# EAGLE schematic 16 ch sample-and-hold card (EAGLE 7.2.0)
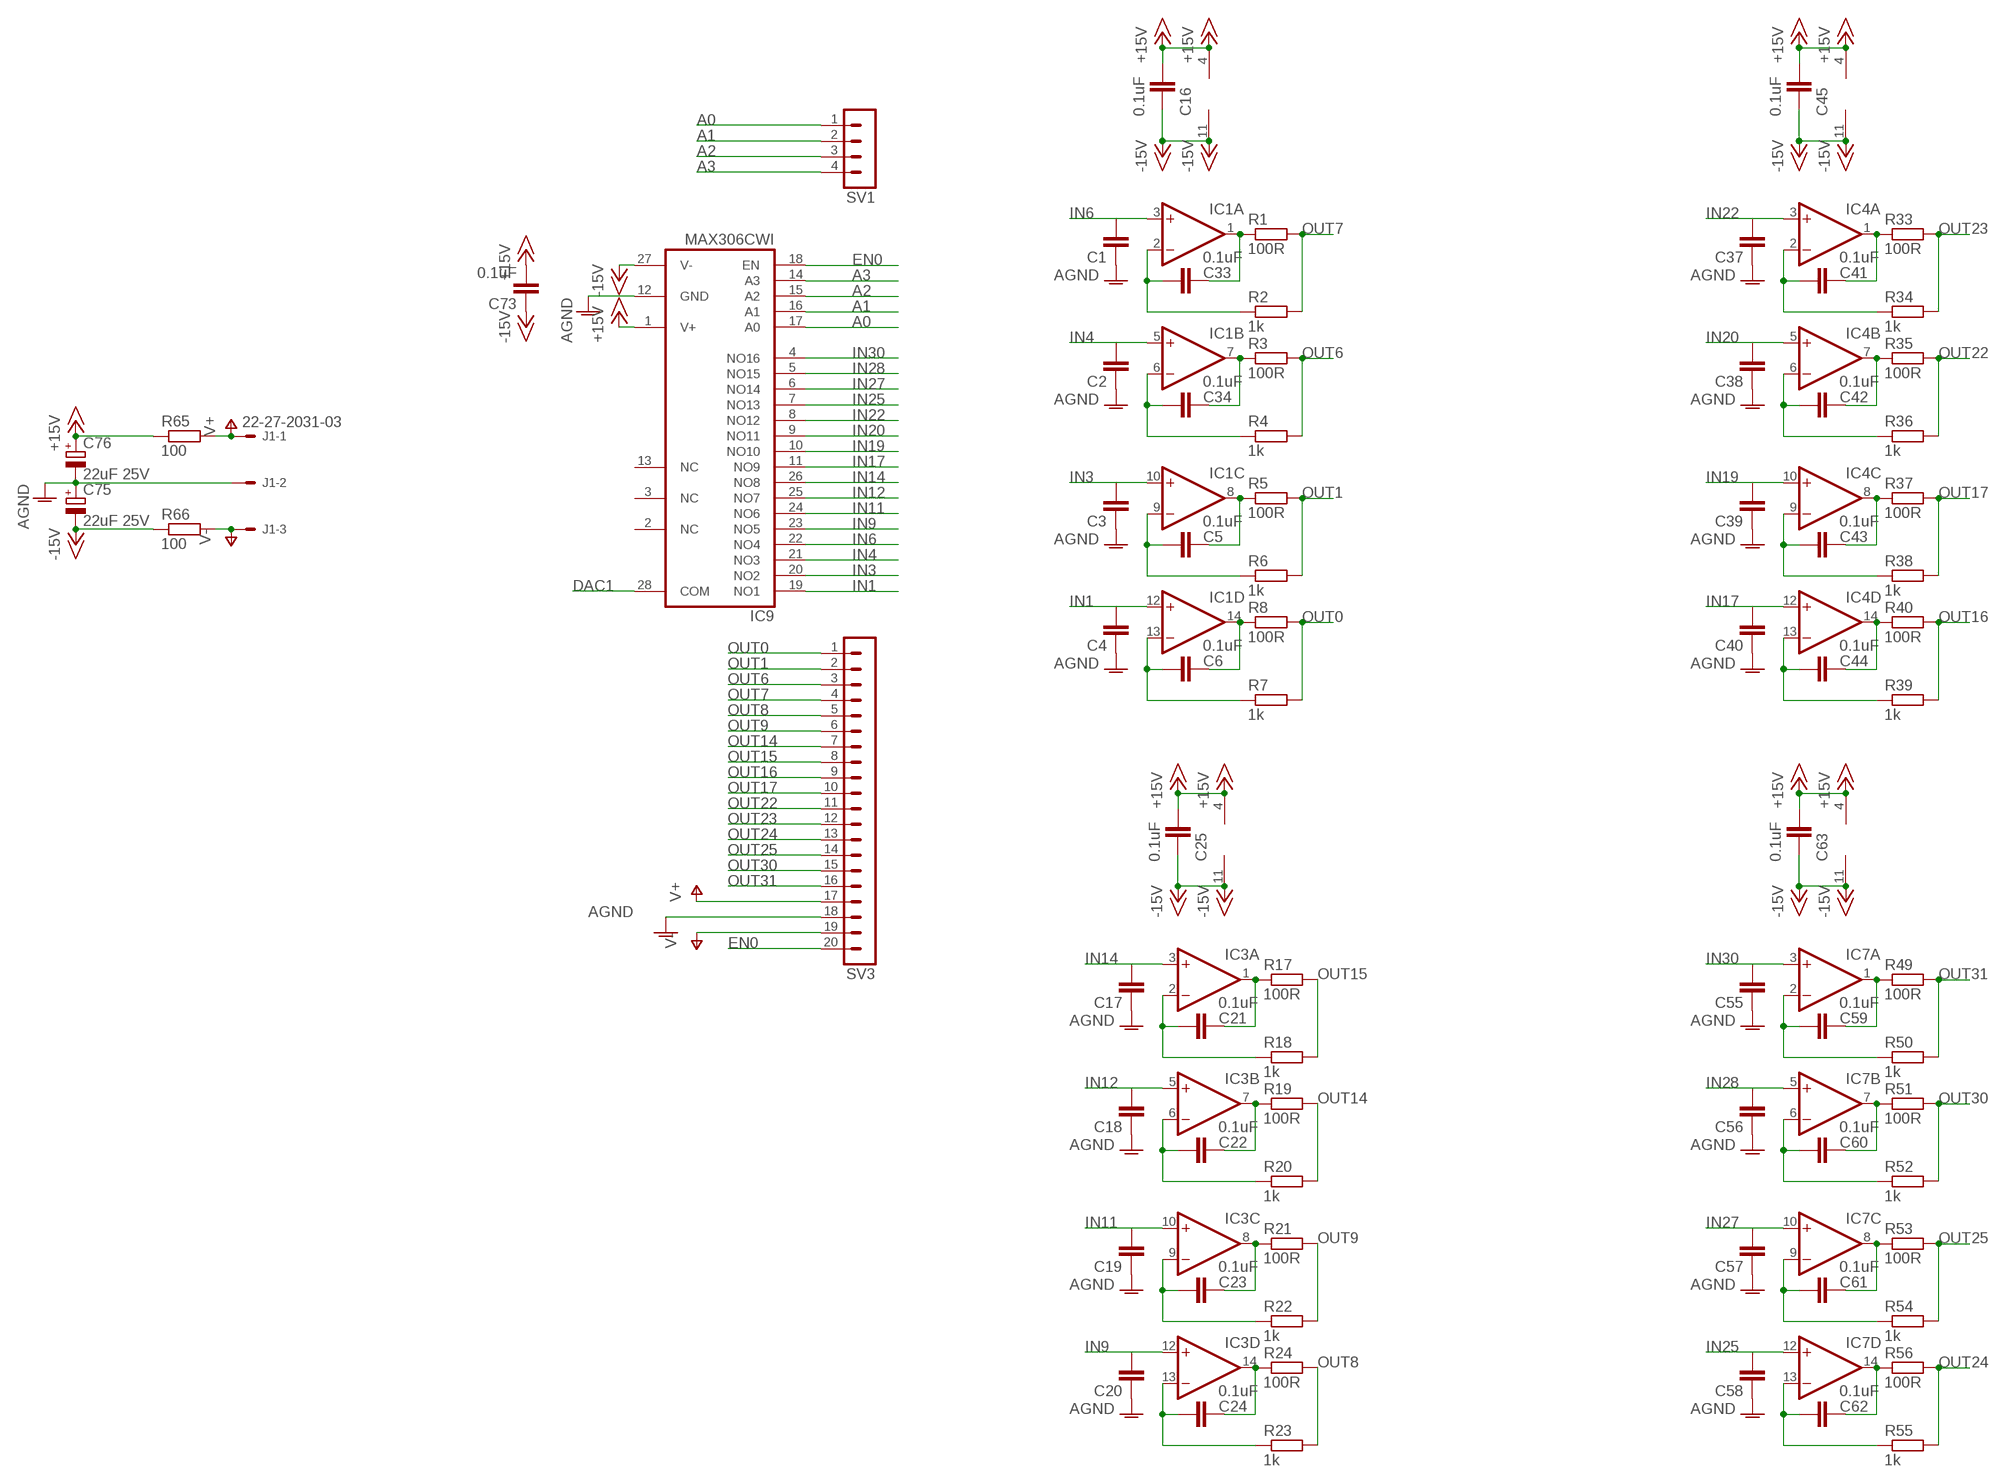
[diagram p0: schematic, sheet 1]

## Parts
C1  C-EUC1206  [C1206]
C2  C-EUC1206  [C1206]
C3  C-EUC1206  [C1206]
C4  C-EUC1206  [C1206]
C5  0.1uF  C-EUC0603  [C0603]
C6  0.1uF  C-EUC0603  [C0603]
C16  0.1uF  C-EUC0603  [C0603]
C17  C-EUC1206  [C1206]
C18  C-EUC1206  [C1206]
C19  C-EUC1206  [C1206]
C20  C-EUC1206  [C1206]
C21  0.1uF  C-EUC0603  [C0603]
C22  0.1uF  C-EUC0603  [C0603]
C23  0.1uF  C-EUC0603  [C0603]
C24  0.1uF  C-EUC0603  [C0603]
C25  0.1uF  C-EUC0603  [C0603]
C33  0.1uF  C-EUC0603  [C0603]
C34  0.1uF  C-EUC0603  [C0603]
C37  C-EUC1206  [C1206]
C38  C-EUC1206  [C1206]
C39  C-EUC1206  [C1206]
C40  C-EUC1206  [C1206]
C41  0.1uF  C-EUC0603  [C0603]
C42  0.1uF  C-EUC0603  [C0603]
C43  0.1uF  C-EUC0603  [C0603]
C44  0.1uF  C-EUC0603  [C0603]
C45  0.1uF  C-EUC0603  [C0603]
C55  C-EUC1206  [C1206]
C56  C-EUC1206  [C1206]
C57  C-EUC1206  [C1206]
C58  C-EUC1206  [C1206]
C59  0.1uF  C-EUC0603  [C0603]
C60  0.1uF  C-EUC0603  [C0603]
C61  0.1uF  C-EUC0603  [C0603]
C62  0.1uF  C-EUC0603  [C0603]
C63  0.1uF  C-EUC0603  [C0603]
C73  0.1uF  C-EUC0603  [C0603]
C75  22uF 25V  CPOL-EUE2-5  [E2-5]
C76  22uF 25V  CPOL-EUE2-5  [E2-5]
IC1  TL074D  [SO14]
IC3  TL074D  [SO14]
IC4  TL074D  [SO14]
IC7  TL074D  [SO14]
IC9  MAX306CWI  [SO28L]
J1  22-27-2031-03  [6410-03]
R1  100R  R-EU_R0603  [R0603]
R2  1k  R-EU_R0603  [R0603]
R3  100R  R-EU_R0603  [R0603]
R4  1k  R-EU_R0603  [R0603]
R5  100R  R-EU_R0603  [R0603]
R6  1k  R-EU_R0603  [R0603]
R7  1k  R-EU_R0603  [R0603]
R8  100R  R-EU_R0603  [R0603]
R17  100R  R-EU_R0603  [R0603]
R18  1k  R-EU_R0603  [R0603]
R19  100R  R-EU_R0603  [R0603]
R20  1k  R-EU_R0603  [R0603]
R21  100R  R-EU_R0603  [R0603]
R22  1k  R-EU_R0603  [R0603]
R23  1k  R-EU_R0603  [R0603]
R24  100R  R-EU_R0603  [R0603]
R33  100R  R-EU_R0603  [R0603]
R34  1k  R-EU_R0603  [R0603]
R35  100R  R-EU_R0603  [R0603]
R36  1k  R-EU_R0603  [R0603]
R37  100R  R-EU_R0603  [R0603]
R38  1k  R-EU_R0603  [R0603]
R39  1k  R-EU_R0603  [R0603]
R40  100R  R-EU_R0603  [R0603]
R49  100R  R-EU_R0603  [R0603]
R50  1k  R-EU_R0603  [R0603]
R51  100R  R-EU_R0603  [R0603]
R52  1k  R-EU_R0603  [R0603]
R53  100R  R-EU_R0603  [R0603]
R54  1k  R-EU_R0603  [R0603]
R55  1k  R-EU_R0603  [R0603]
R56  100R  R-EU_R0603  [R0603]
R65  100  R-EU_0207/7  [0207/7]
R66  100  R-EU_0207/7  [0207/7]
SV1  MA04-1  [MA04-1]
SV3  MA20-1  [MA20-1]

## Nets
+15V: C16.1 C25.1 C45.1 C63.1 C73.2 C76.+ IC1.4(P:V+) IC3.4(P:V+) IC4.4(P:V+) IC7.4(P:V+) IC9.1(V+) R65.1
-15V: C16.2 C25.2 C45.2 C63.2 C73.1 C75.- IC1.11(P:V-) IC3.11(P:V-) IC4.11(P:V-) IC7.11(P:V-) IC9.27(V-) R66.1
A0: IC9.17(A0) SV1.1
A1: IC9.16(A1) SV1.2
A2: IC9.15(A2) SV1.3
A3: IC9.14(A3) SV1.4
AGND: C1.1 C2.1 C3.1 C4.1 C17.1 C18.1 C19.1 C20.1 C37.1 C38.1 C39.1 C40.1 C55.1 C56.1 C57.1 C58.1 C75.+ C76.- IC9.12(GND) J1.2 SV3.18
DAC1: IC9.28(COM)
EN0: IC9.18(EN) SV3.20
IN1: C4.2 IC1.12(D:+IN) IC9.19(NO1)
IN3: C3.2 IC1.10(C:+IN) IC9.20(NO2)
IN4: C2.2 IC1.5(B:+IN) IC9.21(NO3)
IN6: C1.2 IC1.3(A:+IN) IC9.22(NO4)
IN9: C20.2 IC3.12(D:+IN) IC9.23(NO5)
IN11: C19.2 IC3.10(C:+IN) IC9.24(NO6)
IN12: C18.2 IC3.5(B:+IN) IC9.25(NO7)
IN14: C17.2 IC3.3(A:+IN) IC9.26(NO8)
IN17: C40.2 IC4.12(D:+IN) IC9.11(NO9)
IN19: C39.2 IC4.10(C:+IN) IC9.10(NO10)
IN20: C38.2 IC4.5(B:+IN) IC9.9(NO11)
IN22: C37.2 IC4.3(A:+IN) IC9.8(NO12)
IN25: C58.2 IC7.12(D:+IN) IC9.7(NO13)
IN27: C57.2 IC7.10(C:+IN) IC9.6(NO14)
IN28: C56.2 IC7.5(B:+IN) IC9.5(NO15)
IN30: C55.2 IC7.3(A:+IN) IC9.4(NO16)
N$1: C33.2 IC1.2(A:-IN) R2.1
N$2: C33.1 IC1.1(A:OUT) R1.1
N$3: C34.1 IC1.7(B:OUT) R3.1
N$4: C5.1 IC1.8(C:OUT) R5.1
N$5: C34.2 IC1.6(B:-IN) R4.1
N$6: C6.1 IC1.14(D:OUT) R8.1
N$7: C5.2 IC1.9(C:-IN) R6.1
N$8: C6.2 IC1.13(D:-IN) R7.1
N$9: C21.1 IC3.1(A:OUT) R17.1
N$10: C21.2 IC3.2(A:-IN) R18.1
N$19: C22.1 IC3.7(B:OUT) R19.1
N$20: C22.2 IC3.6(B:-IN) R20.1
N$21: C23.1 IC3.8(C:OUT) R21.1
N$22: C24.1 IC3.14(D:OUT) R24.1
N$23: C23.2 IC3.9(C:-IN) R22.1
N$24: C24.2 IC3.13(D:-IN) R23.1
N$33: C41.1 IC4.1(A:OUT) R33.1
N$34: C41.2 IC4.2(A:-IN) R34.1
N$35: C42.1 IC4.7(B:OUT) R35.1
N$36: C42.2 IC4.6(B:-IN) R36.1
N$37: C43.1 IC4.8(C:OUT) R37.1
N$38: C44.1 IC4.14(D:OUT) R40.1
N$39: C43.2 IC4.9(C:-IN) R38.1
N$40: C44.2 IC4.13(D:-IN) R39.1
N$49: C59.1 IC7.1(A:OUT) R49.1
N$50: C59.2 IC7.2(A:-IN) R50.1
N$51: C60.1 IC7.7(B:OUT) R51.1
N$52: C60.2 IC7.6(B:-IN) R52.1
N$53: C61.1 IC7.8(C:OUT) R53.1
N$54: C62.1 IC7.14(D:OUT) R56.1
N$55: C61.2 IC7.9(C:-IN) R54.1
N$56: C62.2 IC7.13(D:-IN) R55.1
OUT0: R7.2 R8.2 SV3.1
OUT1: R5.2 R6.2 SV3.2
OUT6: R3.2 R4.2 SV3.3
OUT7: R1.2 R2.2 SV3.4
OUT8: R23.2 R24.2 SV3.5
OUT9: R21.2 R22.2 SV3.6
OUT14: R19.2 R20.2 SV3.7
OUT15: R17.2 R18.2 SV3.8
OUT16: R39.2 R40.2 SV3.9
OUT17: R37.2 R38.2 SV3.10
OUT22: R35.2 R36.2 SV3.11
OUT23: R33.2 R34.2 SV3.12
OUT24: R55.2 R56.2 SV3.13
OUT25: R53.2 R54.2 SV3.14
OUT30: R51.2 R52.2 SV3.15
OUT31: R49.2 R50.2 SV3.16
V+: J1.1 R65.2 SV3.17
V-: J1.3 R66.2 SV3.19
Unconnected: IC9.2(NC) IC9.3(NC) IC9.13(NC)

## Library data of the parts
C1-C6 C16-C25 C33 C34 C37-C45 C55-C63 C73 = resistor:C-EU: CAPACITOR, European symbol
C75 C76 = resistor:CPOL-EU: POLARIZED CAPACITOR, European symbol
IC1 IC3 IC4 IC7 = linear:TL074: OP AMP
IC9 = maxim:MAX306CWI: MULTIPLEXER; MF: MAXIM; MPN: MAX306CWI; OC_FARNELL: unknown; OC_NEWARK: 90C2555
J1 = con-molex:22-?-03: CONNECTOR wire to board 2.54 mm (.1 inch) pitch header; OC_FARNELL: unknown; OC_NEWARK: unknown
R1-R8 R17-R24 R33-R40 R49-R56 R65 R66 = resistor:R-EU_: RESISTOR, European symbol
SV1 = con-lstb:MA04-1: PIN HEADER; OC_FARNELL: unknown; OC_NEWARK: unknown
SV3 = con-lstb:MA20-1: PIN HEADER; OC_FARNELL: unknown; OC_NEWARK: unknown